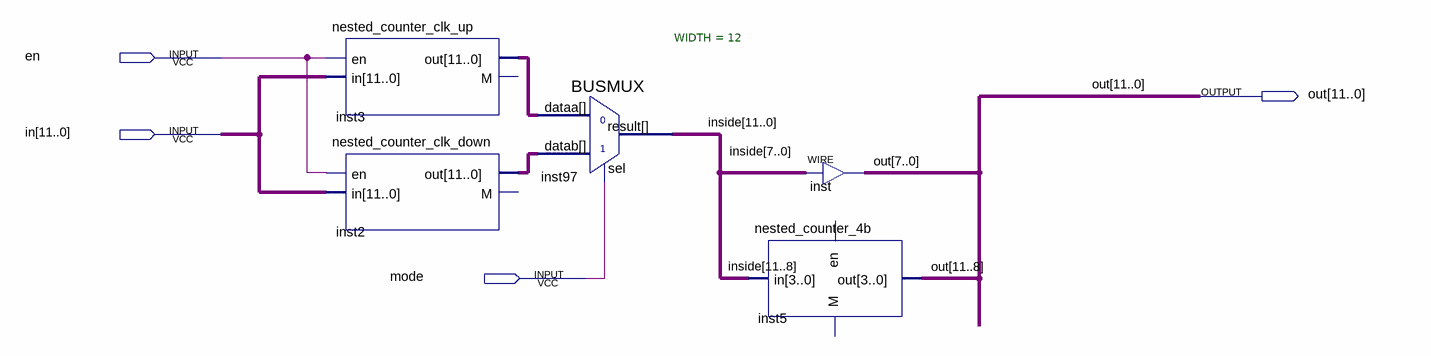
[diagram p0: schematic sheet]
// Quartus schematic nested_counter_clk.bdf as structural Verilog: 5 symbols, 4 pins
module nested_counter_clk (
  input  en,
  input  [11:0] in,
  input  mode,
  output [11:0] out
);

  wire [11:0] \inside , inst2_out, inst3_out;

  nested_counter_clk_up inst3 (.en(en), .in(in), .out(inst3_out));  // open: M
  nested_counter_clk_down inst2 (.en(en), .in(in), .out(inst2_out));  // open: M
  BUSMUX #(.WIDTH(12)) inst97 (.datab(inst2_out), .sel(mode), .dataa(inst3_out), .result(\inside ));
  assign out[7:0] = \inside [7:0];  // WIRE inst
  nested_counter_4b inst5 (.in(\inside [11:8]), .out(out[11:8]));  // open: en, M
endmodule
